# EAGLE design floppy featherwing rev A (EAGLE 9.6.2)
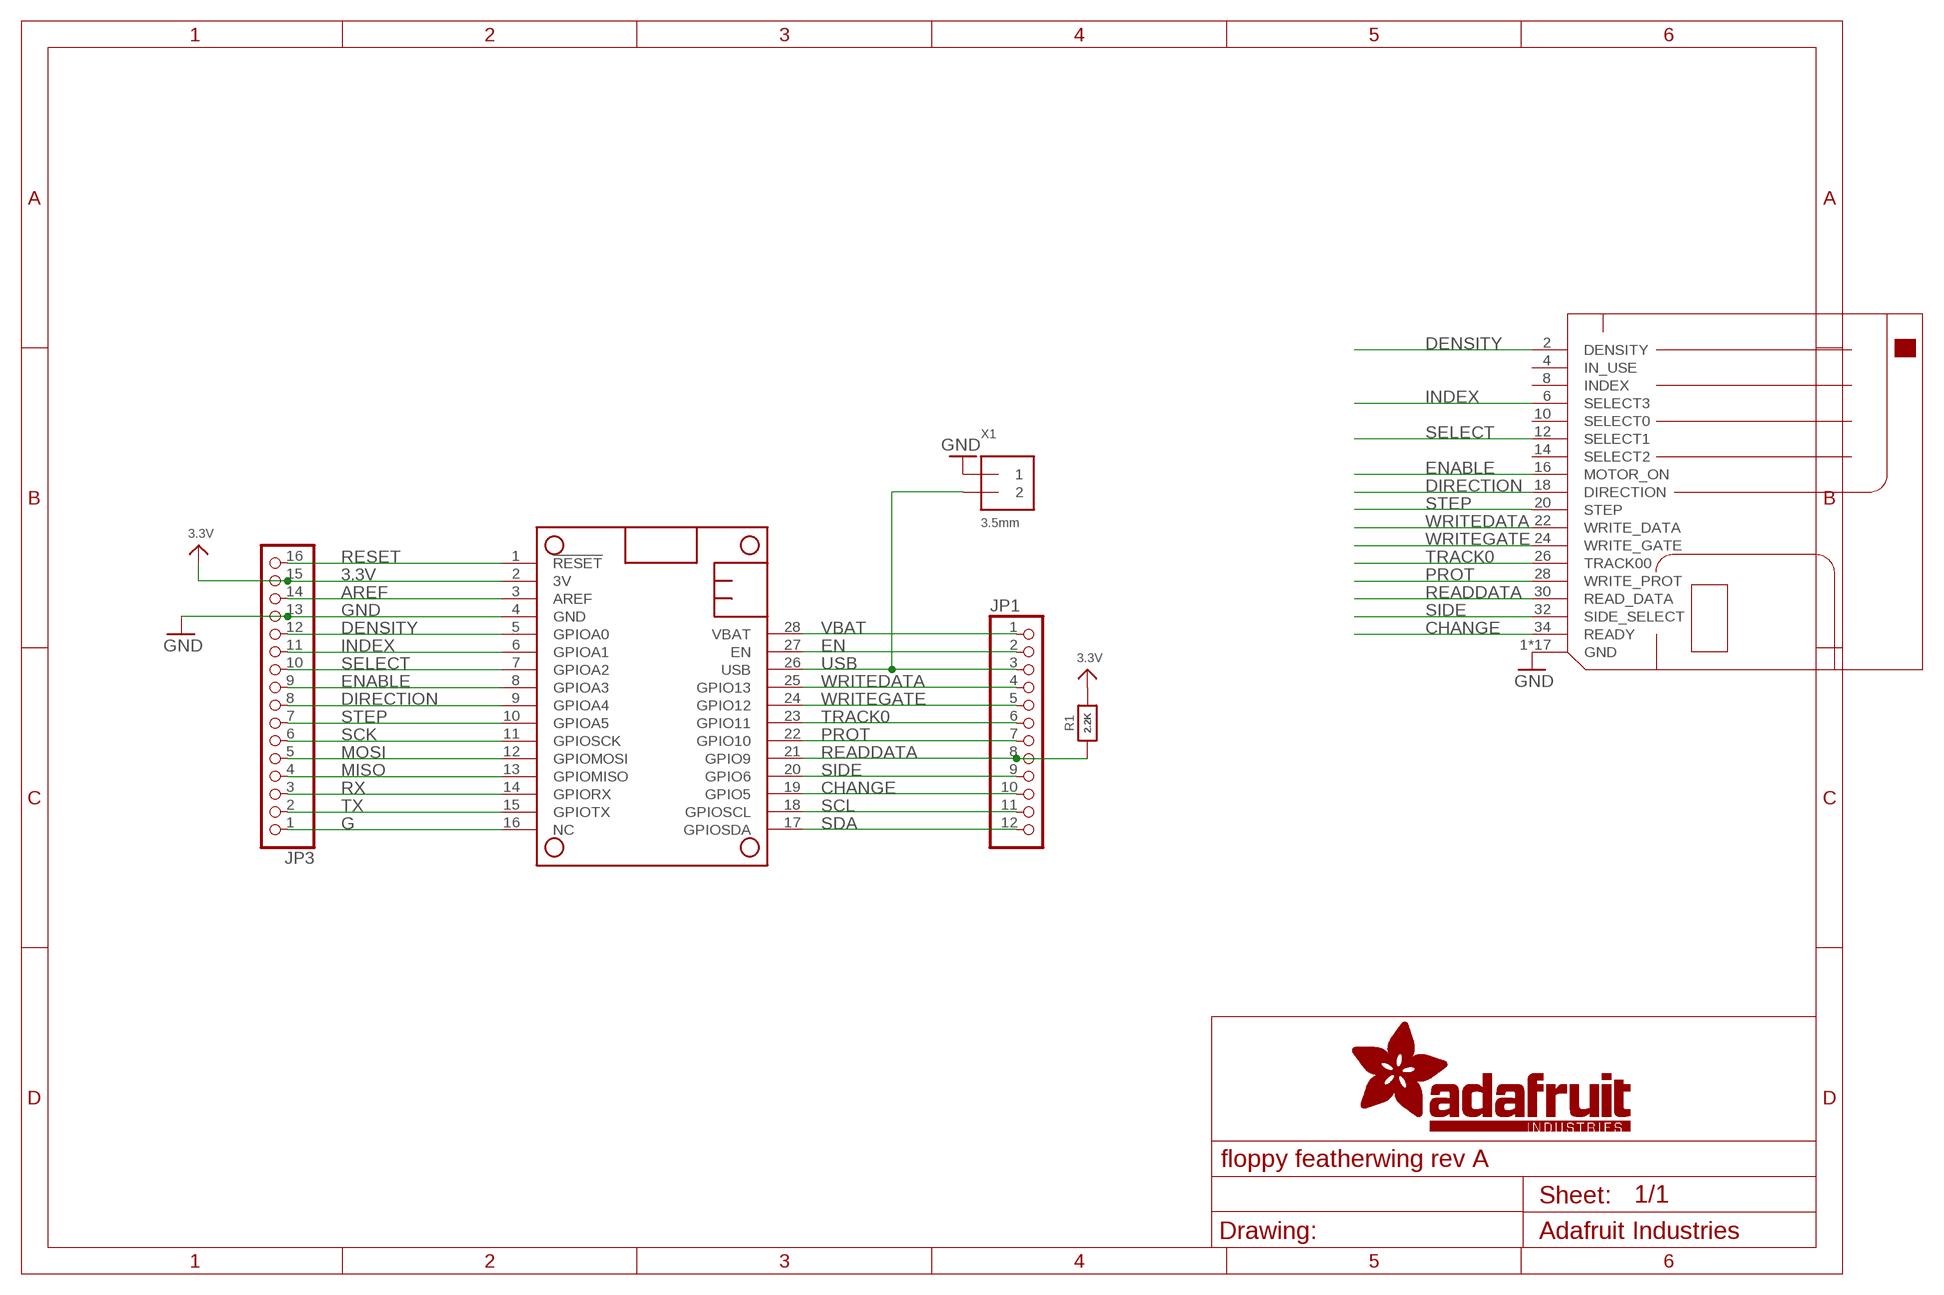
[diagram p0: schematic, sheet 1]

## Parts
FDD1  FLOPPY_IDC_SHROUDED  [2X17_FLOPPY_IDC]
JP1  HEADER-1X12  [1X12_ROUND]
JP3  HEADER-1X16ROUND  [1X16_ROUND]
MS1  FEATHERWING  [FEATHERWING]
R1  2.2K  RESISTOR0805_NOOUTLINE  [0805-NO]
X1  3.5mm  TERMBLOCK_1X2_3.5MM  [TERMBLOCK_1X2-3.5MM]

## Nets
3.3V: JP3.15 MS1.2(3V) R1.2
AREF: JP3.14 MS1.3(AREF)
CHANGE: FDD1.34(READY) JP1.10 MS1.19(GPIO5)
DENSITY: FDD1.2(DENSITY) JP3.12 MS1.5(GPIOA0)
DIRECTION: FDD1.18(DIRECTION) JP3.8 MS1.9(GPIOA4)
EN: JP1.2 MS1.27(EN)
ENABLE: FDD1.16(MOTOR_ON) JP3.9 MS1.8(GPIOA3)
G: JP3.1 MS1.16(NC)
GND: FDD1.1(GND) FDD1.3(GND) FDD1.5(GND) FDD1.7(GND) FDD1.9(GND) FDD1.11(GND) FDD1.13(GND) FDD1.15(GND) FDD1.17(GND) FDD1.19(GND) FDD1.21(GND) FDD1.23(GND) FDD1.25(GND) FDD1.27(GND) FDD1.29(GND) FDD1.31(GND) FDD1.33(GND) JP3.13 MS1.4(GND) X1.1
INDEX: FDD1.6(SELECT3) JP3.11 MS1.6(GPIOA1)
MISO: JP3.4 MS1.13(GPIOMISO)
MOSI: JP3.5 MS1.12(GPIOMOSI)
PROT: FDD1.28(WRITE_PROT) JP1.7 MS1.22(GPIO10)
READDATA: FDD1.30(READ_DATA) JP1.8 MS1.21(GPIO9) R1.1
RESET: JP3.16 MS1.1(!RESET)
RX: JP3.3 MS1.14(GPIORX)
SCK: JP3.6 MS1.11(GPIOSCK)
SCL: JP1.11 MS1.18(GPIOSCL)
SDA: JP1.12 MS1.17(GPIOSDA)
SELECT: FDD1.12(SELECT1) JP3.10 MS1.7(GPIOA2)
SIDE: FDD1.32(SIDE_SELECT) JP1.9 MS1.20(GPIO6)
STEP: FDD1.20(STEP) JP3.7 MS1.10(GPIOA5)
TRACK0: FDD1.26(TRACK00) JP1.6 MS1.23(GPIO11)
TX: JP3.2 MS1.15(GPIOTX)
USB: JP1.3 MS1.26(USB) X1.2
VBAT: JP1.1 MS1.28(VBAT)
WRITEDATA: FDD1.22(WRITE_DATA) JP1.4 MS1.25(GPIO13)
WRITEGATE: FDD1.24(WRITE_GATE) JP1.5 MS1.24(GPIO12)
Unconnected: FDD1.4(IN_USE) FDD1.8(INDEX) FDD1.10(SELECT0) FDD1.14(SELECT2)

## Library data of the parts
FDD1 = adafruit_electromech:FLOPPY_IDC
JP1 = microbuilder:HEADER-1X12
JP3 = microbuilder:HEADER-1X16: PIN HEADER
MS1 = microbuilder:FEATHERWING
R1 = microbuilder:RESISTOR: Resistors For new designs, use the packages preceded by an '_' character since they are more reliable: The following footprints should be used on most boards: _0402 - Standard footprint for regular board layouts _0603 - Standard footprint for regular board layouts _0805 - Standard footprint for regular board layouts _1206 - Standard footprint for regular board layouts For extremely tight-pitch boards where space is at a premium, the following 'micro-pitch' footprints can be used (smaller pads, no silkscreen outline, etc.): _0402MP - Micro-pitch footprint for very dense/compact boards _0603MP - Micro-pitch footprint for very dense/compact boards _0805MP - Micro-pitch footprint for very dense/compact boards _1206MP - Micro-pitch footprint for very dense/compact boards
X1 = adafruit_electromech:TERMBLOCK_1X2: 3.5mm Terminal block http://www.ladyada.net/library/pcb/eaglelibrary.html

## Board
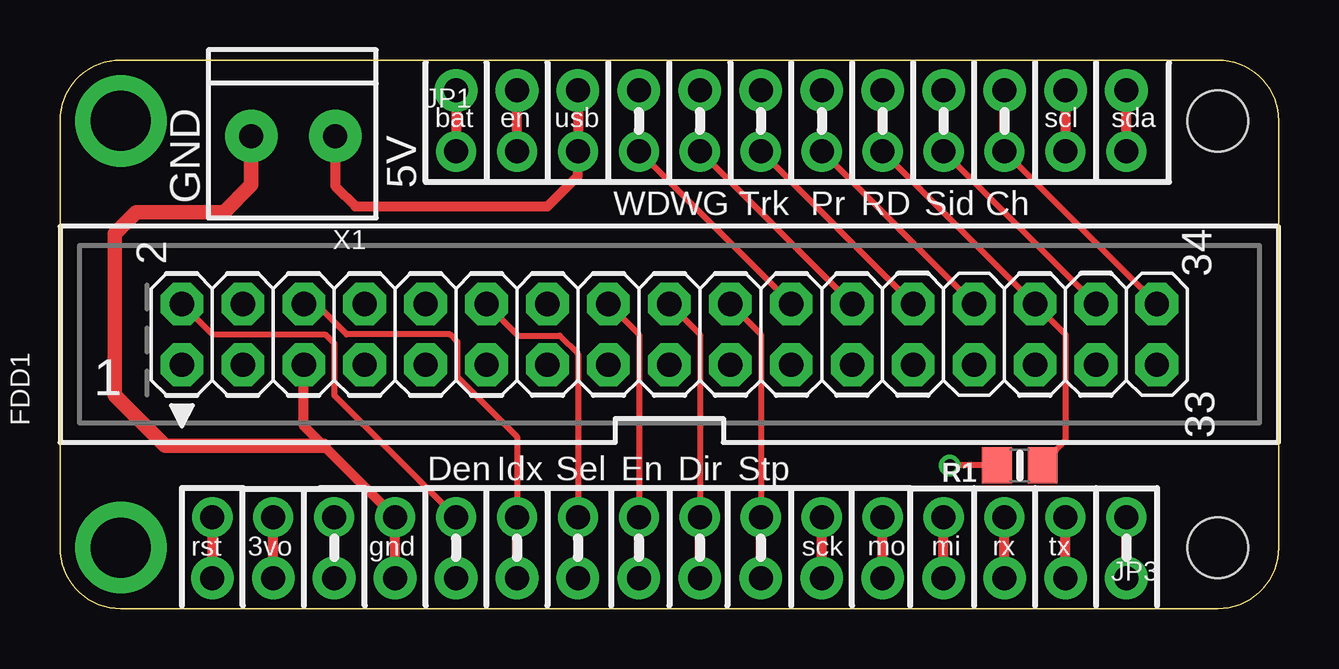
[diagram p1: board, top side]
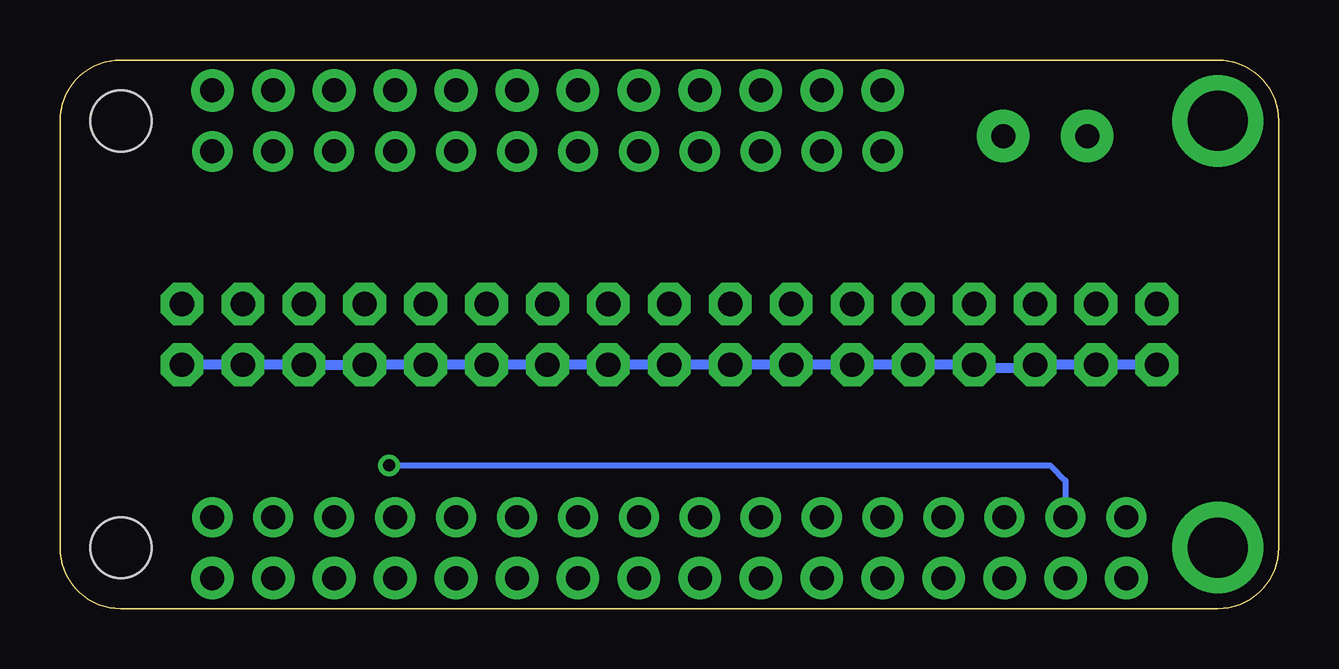
[diagram p2: board, bottom side, seen from below]

Size 50.8 x 22.86 mm. Coordinates in mm from the lower left corner, seen from the top.
Outline: 2.54,22.86 48.26,22.86 arc-90 50.8,20.32 50.8,2.54 arc-90 48.26,0 2.54,0 arc-90 0,2.54 0,20.32 arc-90 2.54,22.86
Copper layers (1*16): Top 0.035mm / dielectric 1.5mm / Bottom 0.035mm
Design rules "adafruit": minimum track width 8mil, minimum drill 15.5mil, track to track 8mil, track to pad 8mil, pad to pad 8mil, via to via 8mil, smd to smd 8mil, copper to edge 10mil, drill to drill 8mil, minimum pad ring 10mil, minimum via ring 8mil, stop-mask expansion 2mil, vias tented up to drill 20mil, thermal gap 10mil

### Footprints (pad centres in the part's own frame; a part is rotated, then mirrored left to right if it is on the bottom)
2X17_FLOPPY_IDC = drill 1.016 pad 1.778 octagon: 1 -1.27,20.32; 2 1.27,20.32; 3 -1.27,17.78; 4 1.27,17.78; 5 -1.27,15.24; 6 1.27,15.24; 7 -1.27,12.7; 8 1.27,12.7; 9 -1.27,10.16; 10 1.27,10.16; 11 -1.27,7.62; 12 1.27,7.62; 13 -1.27,5.08; 14 1.27,5.08; 15 -1.27,2.54; 16 1.27,2.54; 17 -1.27,0; 18 1.27,0; 19 -1.27,-2.54; 20 1.27,-2.54; 21 -1.27,-5.08; 22 1.27,-5.08; 23 -1.27,-7.62; 24 1.27,-7.62; 25 -1.27,-10.16; 26 1.27,-10.16; 27 -1.27,-12.7; 28 1.27,-12.7; 29 -1.27,-15.24; 30 1.27,-15.24; 31 -1.27,-17.78; 32 1.27,-17.78; 33 -1.27,-20.32; 34 1.27,-20.32
1X12_ROUND = drill 1 pad 1.676: 1 -13.97,0; 2 -11.43,0; 3 -8.89,0; 4 -6.35,0; 5 -3.81,0; 6 -1.27,0; 7 1.27,0; 8 3.81,0; 9 6.35,0; 10 8.89,0; 11 11.43,0; 12 13.97,0
1X16_ROUND = drill 1 pad 1.676: 1 -19.05,0; 2 -16.51,0; 3 -13.97,0; 4 -11.43,0; 5 -8.89,0; 6 -6.35,0; 7 -3.81,0; 8 -1.27,0; 9 1.27,0; 10 3.81,0; 11 6.35,0; 12 8.89,0; 13 11.43,0; 14 13.97,0; 15 16.51,0; 16 19.05,0
FEATHERWING = drill 1 pad 1.778: 1 6.35,1.27; 2 8.89,1.27; 3 11.43,1.27; 4 13.97,1.27; 5 16.51,1.27; 6 19.05,1.27; 7 21.59,1.27; 8 24.13,1.27; 9 26.67,1.27; 10 29.21,1.27; 11 31.75,1.27; 12 34.29,1.27; 13 36.83,1.27; 14 39.37,1.27; 15 41.91,1.27; 16 44.45,1.27; 17 44.45,21.59; 18 41.91,21.59; 19 39.37,21.59; 20 36.83,21.59; 21 34.29,21.59; 22 31.75,21.59; 23 29.21,21.59; 24 26.67,21.59; 25 24.13,21.59; 26 21.59,21.59; 27 19.05,21.59; 28 16.51,21.59 | drill 2.5 pad 3.81: P$1 2.54,20.32; P$2 2.54,2.54 | hole 2.54: 48.26,20.32; 48.26,2.54
0805-NO = smd 1.24 x 1.5: 1 -0.95,0; 2 0.95,0
TERMBLOCK_1X2-3.5MM = drill 1 pad 2.184: 1 1.8,0; 2 -1.7,0

### Placement (x,y rotation side)
FDD1  25.4,11.43 90 top
JP1  30.48,19.05 0 top
JP3  25.4,3.81 180 top
MS1  0,0 0 top
R1  40.01,5.97 180 top
X1  9.78,19.68 180 top

### Tracks (layer width: path | path; a pad name or v marks a point on that pad's centre or on a via)
3.3V  (via drill 0.5)
  Top 0.254: R1.2 v37.08,5.97
  Top 0.406: MS1.2 JP3.15
  Bottom 0.254: v37.08,5.97 9.53,5.97 8.89,5.33 JP3.15
AREF
  Top 0.406: JP3.14 MS1.3
CHANGE
  Top 0.254: FDD1.34 JP1.10
  Top 0.406: JP1.10 MS1.19
DENSITY
  Top 0.254: FDD1.2 6.35,11.43 11.05,11.43 11.43,11.05 11.43,8.89 JP3.12
  Top 0.406: JP3.12 MS1.5
DIRECTION
  Top 0.254: FDD1.18 26.67,11.43 26.67,3.68
  Top 0.406: MS1.9 26.67,3.68 JP3.8
EN
  Top 0.406: JP1.2 MS1.27
ENABLE
  Top 0.254: FDD1.16 24.13,11.43 JP3.9
  Top 0.406: MS1.8 JP3.9
G
  Top 0.406: MS1.16 JP3.1
GND
  Top 0.406: MS1.4 JP3.13 10.99,6.79 10.16,7.62 FDD1.5
  Top 0.61: X1.1 7.98,17.65 6.84,16.51 3.17,16.51 2.29,15.62 2.29,8.89 4.38,6.79 10.99,6.79
  Bottom 0.406: FDD1.1 FDD1.3 FDD1.5 10.29,10.03 12.57,10.03 FDD1.7 FDD1.9 FDD1.11 FDD1.13 FDD1.15 FDD1.17 FDD1.19 FDD1.21 FDD1.23 FDD1.25 FDD1.27 FDD1.29 FDD1.31 FDD1.33
INDEX
  Top 0.254: JP3.11 19.05,7.17 16.56,9.65 16.56,11.12 16.26,11.43 11.94,11.43 10.67,12.7 FDD1.6
  Top 0.406: MS1.6 JP3.11
MISO
  Top 0.406: MS1.13 JP3.4
MOSI
  Top 0.406: MS1.12 JP3.5
PROT
  Top 0.254: JP1.7 FDD1.28
  Top 0.406: MS1.22 JP1.7
READDATA
  Top 0.254: JP1.8 FDD1.30 41.91,11.43 41.91,7.02 R1.1
  Top 0.406: JP1.8 MS1.21
RESET
  Top 0.406: JP3.16 MS1.1
RX
  Top 0.406: MS1.14 JP3.3
SCK
  Top 0.406: MS1.11 JP3.6
SCL
  Top 0.406: MS1.18 JP1.11
SDA
  Top 0.406: JP1.12 MS1.17
SELECT
  Top 0.254: FDD1.12 19.1,11.38 20.82,11.38 21.59,10.61 JP3.10
  Top 0.406: JP3.10 MS1.7
SIDE
  Top 0.254: JP1.9 FDD1.32
  Top 0.406: MS1.20 JP1.9
STEP
  Top 0.254: FDD1.20 29.21,11.43 JP3.7
  Top 0.406: MS1.10 JP3.7
TRACK0
  Top 0.254: JP1.6 FDD1.26
  Top 0.406: MS1.23 JP1.6
TX
  Top 0.406: MS1.15 JP3.2
USB
  Top 0.406: MS1.26 JP1.3 21.59,18.03 20.32,16.76 12.32,16.76 11.48,17.6 X1.2
VBAT
  Top 0.406: MS1.28 JP1.1
WRITEDATA
  Top 0.254: JP1.4 FDD1.22
  Top 0.406: MS1.25 JP1.4
WRITEGATE
  Top 0.254: JP1.5 FDD1.24
  Top 0.406: MS1.24 JP1.5

### Text on the board
tPlace: bat | en | usb | scl | sda | 5V | GND | WD | WG | Trk | Pr | RD | Sid | Ch | 2 | 34 | 33 | Den | Idx | Sel | En | Dir | Stp | rst | 3vo | gnd | sck | mo | mi | rx | tx